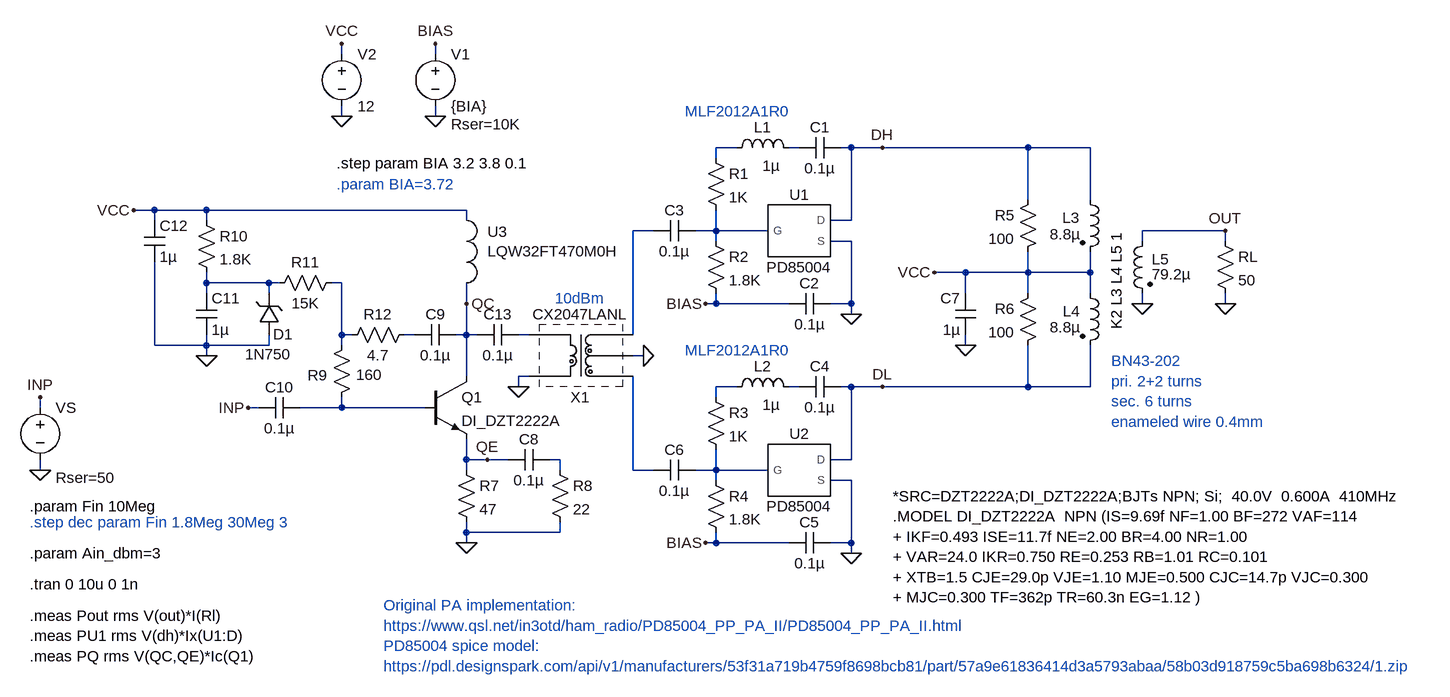
[diagram p0: schematic lp-amp.asc]
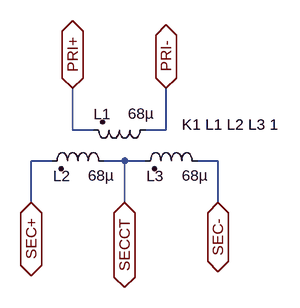
[diagram p1: sub-circuit cx2047lanl.asc]
lp-amp.asc, the LTspice schematic file:
Version 4
SHEET 1 1520 904
WIRE -432 -96 -432 -112
WIRE -288 -96 -288 -112
WIRE -432 0 -432 -16
WIRE -288 0 -288 -16
WIRE 176 48 144 48
WIRE 272 48 256 48
WIRE 352 48 336 48
WIRE 400 48 352 48
WIRE 624 48 400 48
WIRE 720 48 624 48
WIRE 144 64 144 48
WIRE 624 128 624 48
WIRE 720 128 720 48
WIRE -720 144 -752 144
WIRE -640 144 -720 144
WIRE -240 144 -640 144
WIRE -720 160 -720 144
WIRE -640 160 -640 144
WIRE -240 160 -240 144
WIRE 352 160 352 48
WIRE 352 160 320 160
WIRE 48 176 16 176
WIRE 144 176 144 144
WIRE 144 176 112 176
WIRE 224 176 144 176
WIRE 928 176 800 176
WIRE 144 192 144 176
WIRE 352 192 320 192
WIRE 800 192 800 176
WIRE 928 192 928 176
WIRE 528 240 480 240
WIRE 624 240 624 208
WIRE 624 240 528 240
WIRE 720 240 720 208
WIRE 720 240 624 240
WIRE -640 256 -640 240
WIRE -544 256 -640 256
WIRE -528 256 -544 256
WIRE -432 256 -448 256
WIRE -640 272 -640 256
WIRE -544 272 -544 256
WIRE 528 272 528 240
WIRE 624 272 624 240
WIRE 720 272 720 240
WIRE -240 288 -240 256
WIRE 144 288 144 272
WIRE 144 288 128 288
WIRE 256 288 144 288
WIRE 352 288 352 192
WIRE 352 288 320 288
WIRE 800 288 800 272
WIRE 928 288 928 272
WIRE 352 304 352 288
WIRE -432 336 -432 256
WIRE -416 336 -432 336
WIRE -320 336 -336 336
WIRE -240 336 -240 288
WIRE -240 336 -256 336
WIRE -224 336 -240 336
WIRE -144 336 -160 336
WIRE 16 336 16 176
WIRE -720 352 -720 224
WIRE -640 352 -640 336
WIRE -640 352 -720 352
WIRE -544 352 -544 336
WIRE -544 352 -640 352
WIRE -432 352 -432 336
WIRE 528 352 528 336
WIRE -640 368 -640 352
WIRE 32 368 16 368
WIRE -240 400 -240 336
WIRE -144 400 -160 400
WIRE -160 416 -160 400
WIRE 176 416 144 416
WIRE 272 416 256 416
WIRE 352 416 336 416
WIRE 400 416 352 416
WIRE 624 416 624 352
WIRE 624 416 400 416
WIRE 720 416 720 352
WIRE 720 416 624 416
WIRE 144 432 144 416
WIRE -896 448 -896 432
WIRE -560 448 -576 448
WIRE -432 448 -432 432
WIRE -432 448 -496 448
WIRE -304 448 -432 448
WIRE -240 528 -240 496
WIRE -208 528 -240 528
WIRE -176 528 -208 528
WIRE -96 528 -112 528
WIRE 352 528 352 416
WIRE 352 528 320 528
WIRE -896 544 -896 528
WIRE -240 544 -240 528
WIRE -96 544 -96 528
WIRE 16 544 16 400
WIRE 48 544 16 544
WIRE 144 544 144 512
WIRE 144 544 112 544
WIRE 224 544 144 544
WIRE 144 560 144 544
WIRE 352 560 320 560
WIRE -240 640 -240 624
WIRE -96 640 -96 624
WIRE -96 640 -240 640
WIRE -240 656 -240 640
WIRE 144 656 144 640
WIRE 144 656 128 656
WIRE 256 656 144 656
WIRE 352 656 352 560
WIRE 352 656 320 656
WIRE 352 672 352 656
FLAG 352 304 0
FLAG 352 672 0
FLAG 128 288 BIAS
FLAG 128 656 BIAS
FLAG 32 368 0
FLAG 480 240 VCC
FLAG 800 288 0
FLAG 528 352 0
FLAG 928 288 0
FLAG 928 176 OUT
FLAG -432 0 0
FLAG -288 0 0
FLAG -432 -112 VCC
FLAG -288 -112 BIAS
FLAG -896 544 0
FLAG 400 48 DH
FLAG 400 416 DL
FLAG -240 656 0
FLAG -640 368 0
FLAG -752 144 VCC
FLAG -240 288 QC
FLAG -208 528 QE
FLAG -576 448 INP
FLAG -896 432 INP
FLAG -160 416 0
SYMBOL PD85004 272 176 R0
SYMATTR InstName U1
SYMBOL res 128 48 R0
SYMATTR InstName R1
SYMATTR Value 1K
SYMBOL cap 336 32 R90
WINDOW 0 0 32 VBottom 2
WINDOW 3 32 32 VTop 2
SYMATTR InstName C1
SYMATTR Value 0.1µ
SYMBOL res 128 176 R0
SYMATTR InstName R2
SYMATTR Value 1.8K
SYMBOL cap 320 272 R90
WINDOW 0 0 32 VBottom 2
WINDOW 3 32 32 VTop 2
SYMATTR InstName C2
SYMATTR Value 0.1µ
SYMBOL cap 112 160 R90
WINDOW 0 0 32 VBottom 2
WINDOW 3 32 32 VTop 2
SYMATTR InstName C3
SYMATTR Value 0.1µ
SYMBOL PD85004 272 544 R0
SYMATTR InstName U2
SYMBOL res 128 416 R0
SYMATTR InstName R3
SYMATTR Value 1K
SYMBOL cap 336 400 R90
WINDOW 0 0 32 VBottom 2
WINDOW 3 32 32 VTop 2
SYMATTR InstName C4
SYMATTR Value 0.1µ
SYMBOL res 128 544 R0
SYMATTR InstName R4
SYMATTR Value 1.8K
SYMBOL cap 320 640 R90
WINDOW 0 0 32 VBottom 2
WINDOW 3 32 32 VTop 2
SYMATTR InstName C5
SYMATTR Value 0.1µ
SYMBOL cap 112 528 R90
WINDOW 0 0 32 VBottom 2
WINDOW 3 32 32 VTop 2
SYMATTR InstName C6
SYMATTR Value 0.1µ
SYMBOL ind2 816 176 M0
WINDOW 0 1 44 Right 2
WINDOW 3 1 67 Right 2
SYMATTR InstName L5
SYMATTR Value 79.2µ
SYMATTR Type ind
SYMBOL ind2 704 112 R0
WINDOW 0 0 44 Right 2
WINDOW 3 1 69 Right 2
SYMATTR InstName L3
SYMATTR Value 8.8µ
SYMATTR Type ind
SYMBOL ind2 704 256 R0
WINDOW 0 1 44 Right 2
WINDOW 3 1 68 Right 2
SYMATTR InstName L4
SYMATTR Value 8.8µ
SYMATTR Type ind
SYMBOL res 640 112 M0
SYMATTR InstName R5
SYMATTR Value 100
SYMBOL res 640 256 M0
SYMATTR InstName R6
SYMATTR Value 100
SYMBOL cap 544 336 R180
WINDOW 0 24 56 Left 2
WINDOW 3 24 8 Left 2
SYMATTR InstName C7
SYMATTR Value 1µ
SYMBOL res 912 176 R0
SYMATTR InstName RL
SYMATTR Value 50
SYMBOL voltage -288 -112 R0
WINDOW 123 0 0 Left 0
WINDOW 39 24 124 Left 2
SYMATTR SpiceLine Rser=10K
SYMATTR InstName V1
SYMATTR Value {BIA}
SYMBOL voltage -432 -112 R0
WINDOW 123 0 0 Left 0
WINDOW 39 0 0 Left 0
SYMATTR InstName V2
SYMATTR Value 12
SYMBOL voltage -896 432 R0
WINDOW 123 0 0 Left 0
WINDOW 39 24 124 Left 2
WINDOW 3 24 96 Invisible 2
SYMATTR SpiceLine Rser=50
SYMATTR Value SINE(0 {2.83*sqrt(5e-2*pow(10, Ain_dbm/10))} {Fin})
SYMATTR InstName VS
SYMBOL ind 160 64 R270
WINDOW 0 32 56 VTop 2
WINDOW 3 4 69 VBottom 2
SYMATTR InstName L1
SYMATTR Value 1µ
SYMATTR SpiceLine Ipk=80m Rser=0.15 Rpar=870 Cpar=0.989p
SYMBOL CX2047LANL -64 368 R180
SYMATTR InstName X1
SYMBOL npn -304 400 R0
SYMATTR InstName Q1
SYMATTR Value DI_DZT2222A
SYMBOL res -256 528 R0
SYMATTR InstName R7
SYMATTR Value 47
SYMBOL res -112 528 R0
SYMATTR InstName R8
SYMATTR Value 22
SYMBOL cap -112 512 R90
WINDOW 0 0 32 VBottom 2
WINDOW 3 32 32 VTop 2
SYMATTR InstName C8
SYMATTR Value 0.1µ
SYMBOL cap -256 320 R90
WINDOW 0 0 32 VBottom 2
WINDOW 3 32 32 VTop 2
SYMATTR InstName C9
SYMATTR Value 0.1µ
SYMBOL res -416 336 M0
WINDOW 0 38 62 Left 2
WINDOW 3 -6 61 Right 2
SYMATTR InstName R9
SYMATTR Value 160
SYMBOL cap -496 432 R90
WINDOW 0 0 32 VBottom 2
WINDOW 3 32 32 VTop 2
SYMATTR InstName C10
SYMATTR Value 0.1µ
SYMBOL zener -560 336 M180
WINDOW 0 22 1 Left 2
WINDOW 3 -21 -30 Left 2
SYMATTR InstName D1
SYMATTR Value 1N750
SYMATTR Description Diode
SYMATTR Type diode
SYMBOL cap -656 272 R0
SYMATTR InstName C11
SYMATTR Value 1µ
SYMBOL res -656 144 R0
SYMATTR InstName R10
SYMATTR Value 1.8K
SYMBOL cap -736 160 R0
SYMATTR InstName C12
SYMATTR Value 1µ
SYMBOL res -432 240 R90
WINDOW 0 0 56 VBottom 2
WINDOW 3 32 56 VTop 2
SYMATTR InstName R11
SYMATTR Value 15K
SYMBOL res -320 320 R90
WINDOW 0 0 56 VBottom 2
WINDOW 3 32 56 VTop 2
SYMATTR InstName R12
SYMATTR Value 4.7
SYMBOL ind 160 432 R270
WINDOW 0 32 56 VTop 2
WINDOW 3 4 69 VBottom 2
SYMATTR InstName L2
SYMATTR Value 1µ
SYMATTR SpiceLine Ipk=80m Rser=0.15 Rpar=870 Cpar=0.989p
SYMBOL cap -160 320 R90
WINDOW 0 0 32 VBottom 2
WINDOW 3 32 32 VTop 2
SYMATTR InstName C13
SYMATTR Value 0.1µ
SYMBOL LQW32FT470M0H -240 208 R90
WINDOW 0 -31 -32 VLeft 2
WINDOW 3 -1 -32 VLeft 2
SYMATTR InstName U3
TEXT 760 328 VLeft 2 !K2 L3 L4 L5 1
TEXT -440 72 Left 2 !.step param BIA 3.2 3.8 0.1
TEXT -912 720 Left 2 !.tran 0 10u 0 1n
TEXT -440 104 Left 2 ;.param BIA=3.72
TEXT -368 752 Left 2 ;Original PA implementation:\nhttps://www.qsl.net/in3otd/ham_radio/PD85004_PP_PA_II/PD85004_PP_PA_II.html\nPD85004 spice model:\nhttps://pdl.designspark.com/api/v1/manufacturers/53f31a719b4759f8698bcb81/part/57a9e61836414d3a5793abaa/58b03d918759c5ba698b6324/1.zip
TEXT -912 768 Left 2 !.meas Pout rms V(out)*I(Rl)\n.meas PU1 rms V(dh)*Ix(U1:D)\n.meas PQ rms V(QC,QE)*Ic(Q1)
TEXT 752 376 Left 2 ;BN43-202\npri. 2+2 turns\nsec. 6 turns\nenameled wire 0.4mm
TEXT -104 280 Left 2 ;10dBm
TEXT 96 -8 Left 2 ;MLF2012A1R0
TEXT 96 360 Left 2 ;MLF2012A1R0
TEXT 416 584 Left 2 !*SRC=DZT2222A;DI_DZT2222A;BJTs NPN; Si;  40.0V  0.600A  410MHz\n.MODEL DI_DZT2222A  NPN (IS=9.69f NF=1.00 BF=272 VAF=114\n+ IKF=0.493 ISE=11.7f NE=2.00 BR=4.00 NR=1.00\n+ VAR=24.0 IKR=0.750 RE=0.253 RB=1.01 RC=0.101\n+ XTB=1.5 CJE=29.0p VJE=1.10 MJE=0.500 CJC=14.7p VJC=0.300\n+ MJC=0.300 TF=362p TR=60.3n EG=1.12 )
TEXT -912 600 Left 2 !.param Fin 10Meg
TEXT -912 624 Left 2 ;.step dec param Fin 1.8Meg 30Meg 3
TEXT -912 672 Left 2 !.param Ain_dbm=3

cx2047lanl.asc, the sub-circuit schematic file:
Version 4
SHEET 1 880 680
WIRE 16 112 16 48
WIRE 48 112 16 112
WIRE 160 112 160 48
WIRE 160 112 128 112
WIRE -16 160 -48 160
WIRE 96 160 64 160
WIRE 128 160 96 160
WIRE 240 160 208 160
WIRE -48 224 -48 160
WIRE 96 224 96 160
WIRE 240 224 240 160
FLAG 16 48 PRI+
IOPIN 16 48 BiDir
FLAG 160 48 PRI-
IOPIN 160 48 BiDir
FLAG 96 224 SECCT
IOPIN 96 224 BiDir
FLAG 240 224 SEC-
IOPIN 240 224 BiDir
FLAG -48 224 SEC+
IOPIN -48 224 BiDir
SYMBOL ind2 144 96 R90
WINDOW 0 -8 69 VRight 2
WINDOW 3 -9 43 VLeft 2
SYMATTR InstName L1
SYMATTR Value 68µ
SYMATTR Type ind
SYMBOL ind2 80 176 M270
WINDOW 0 -7 67 VRight 2
WINDOW 3 -6 40 VLeft 2
SYMATTR InstName L2
SYMATTR Value 68µ
SYMATTR Type ind
SYMBOL ind2 224 176 M270
WINDOW 0 -7 67 VRight 2
WINDOW 3 -6 40 VLeft 2
SYMATTR InstName L3
SYMATTR Value 68µ
SYMATTR Type ind
TEXT 184 104 Left 2 !K1 L1 L2 L3 1

The netlist it stands for:
* lp-amp.asc
XU1 N004 DH 0 PD85004  ; pins G D S
R1 N001 N004 1K
C1 DH N002 0.1µ
R2 N004 BIAS 1.8K
C2 0 BIAS 0.1µ
C3 N004 N003 0.1µ
XU2 N014 DL 0 PD85004  ; pins G D S
R3 N009 N014 1K
C4 DL N010 0.1µ
R4 N014 BIAS 1.8K
C5 0 BIAS 0.1µ
C6 N014 N013 0.1µ
L5 OUT 0 79.2µ
L3 DH VCC 8.8µ
L4 VCC DL 8.8µ
R5 DH VCC 100
R6 VCC DL 100
C7 0 VCC 1µ
RL OUT 0 50
V1 BIAS 0 {BIA} Rser=10K
V2 VCC 0 12
VS INP 0 SINE(0 {2.83*sqrt(5e-2*pow(10, Ain_dbm/10))} {Fin}) Rser=50
L1 N001 N002 1µ Ipk=80m Rser=0.15 Rpar=870 Cpar=0.989p
XX1 N013 0 N003 0 N008 cx2047lanl params: CX2047LANL
Q1 QC N011 QE 0 DI_DZT2222A
R7 QE 0 47
R8 N012 0 22
C8 N012 QE 0.1µ
C9 QC N007 0.1µ
R9 N006 N011 160
C10 N011 INP 0.1µ
D1 0 N005 1N750
C11 N005 0 1µ
R10 VCC N005 1.8K
C12 VCC 0 1µ
R11 N006 N005 15K
R12 N007 N006 4.7
L2 N009 N010 1µ Ipk=80m Rser=0.15 Rpar=870 Cpar=0.989p
C13 N008 QC 0.1µ
XU3 VCC QC LQW32FT470M0H  ; pins port1 port2

* block symbol definitions
.subckt cx2047lanl SEC+ SECCT SEC- PRI+ PRI-
L1 PRI- PRI+ 68µ
L2 SECCT SEC+ 68µ
L3 SEC- SECCT 68µ
K1 L1 L2 L3 1
.ends cx2047lanl

.model D D
.lib standard.dio
.model NPN NPN
.model PNP PNP
.lib standard.bjt
K2 L3 L4 L5 1
.step param BIA 3.2 3.8 0.1
.tran 0 10u 0 1n
* .param BIA=3.72
* Original PA implementation:
* https://www.qsl.net/in3otd/ham_radio/PD85004_PP_PA_II/PD85004_PP_PA_II.html
* PD85004 spice model:
* https://pdl.designspark.com/api/v1/manufacturers/53f31a719b4759f8698bcb81/part/57a9e61836414d3a5793abaa/58b03d918759c5ba698b6324/1.zip
.meas Pout rms V(out)*I(Rl)
.meas PU1 rms V(dh)*Ix(U1:D)
.meas PQ rms V(QC,QE)*Ic(Q1)
* BN43-202
* pri. 2+2 turns
* sec. 6 turns
* enameled wire 0.4mm
* 10dBm
* MLF2012A1R0
* MLF2012A1R0
*SRC=DZT2222A;DI_DZT2222A;BJTs NPN; Si;  40.0V  0.600A  410MHz
.MODEL DI_DZT2222A  NPN (IS=9.69f NF=1.00 BF=272 VAF=114
+ IKF=0.493 ISE=11.7f NE=2.00 BR=4.00 NR=1.00
+ VAR=24.0 IKR=0.750 RE=0.253 RB=1.01 RC=0.101
+ XTB=1.5 CJE=29.0p VJE=1.10 MJE=0.500 CJC=14.7p VJC=0.300
+ MJC=0.300 TF=362p TR=60.3n EG=1.12 )
.param Fin 10Meg
* .step dec param Fin 1.8Meg 30Meg 3
.param Ain_dbm=3
.lib PD85004_rev1_0.lib
.lib LQW32FT470M0H.mod
.backanno
.end